# EAGLE design main (EAGLE 7.5.0)
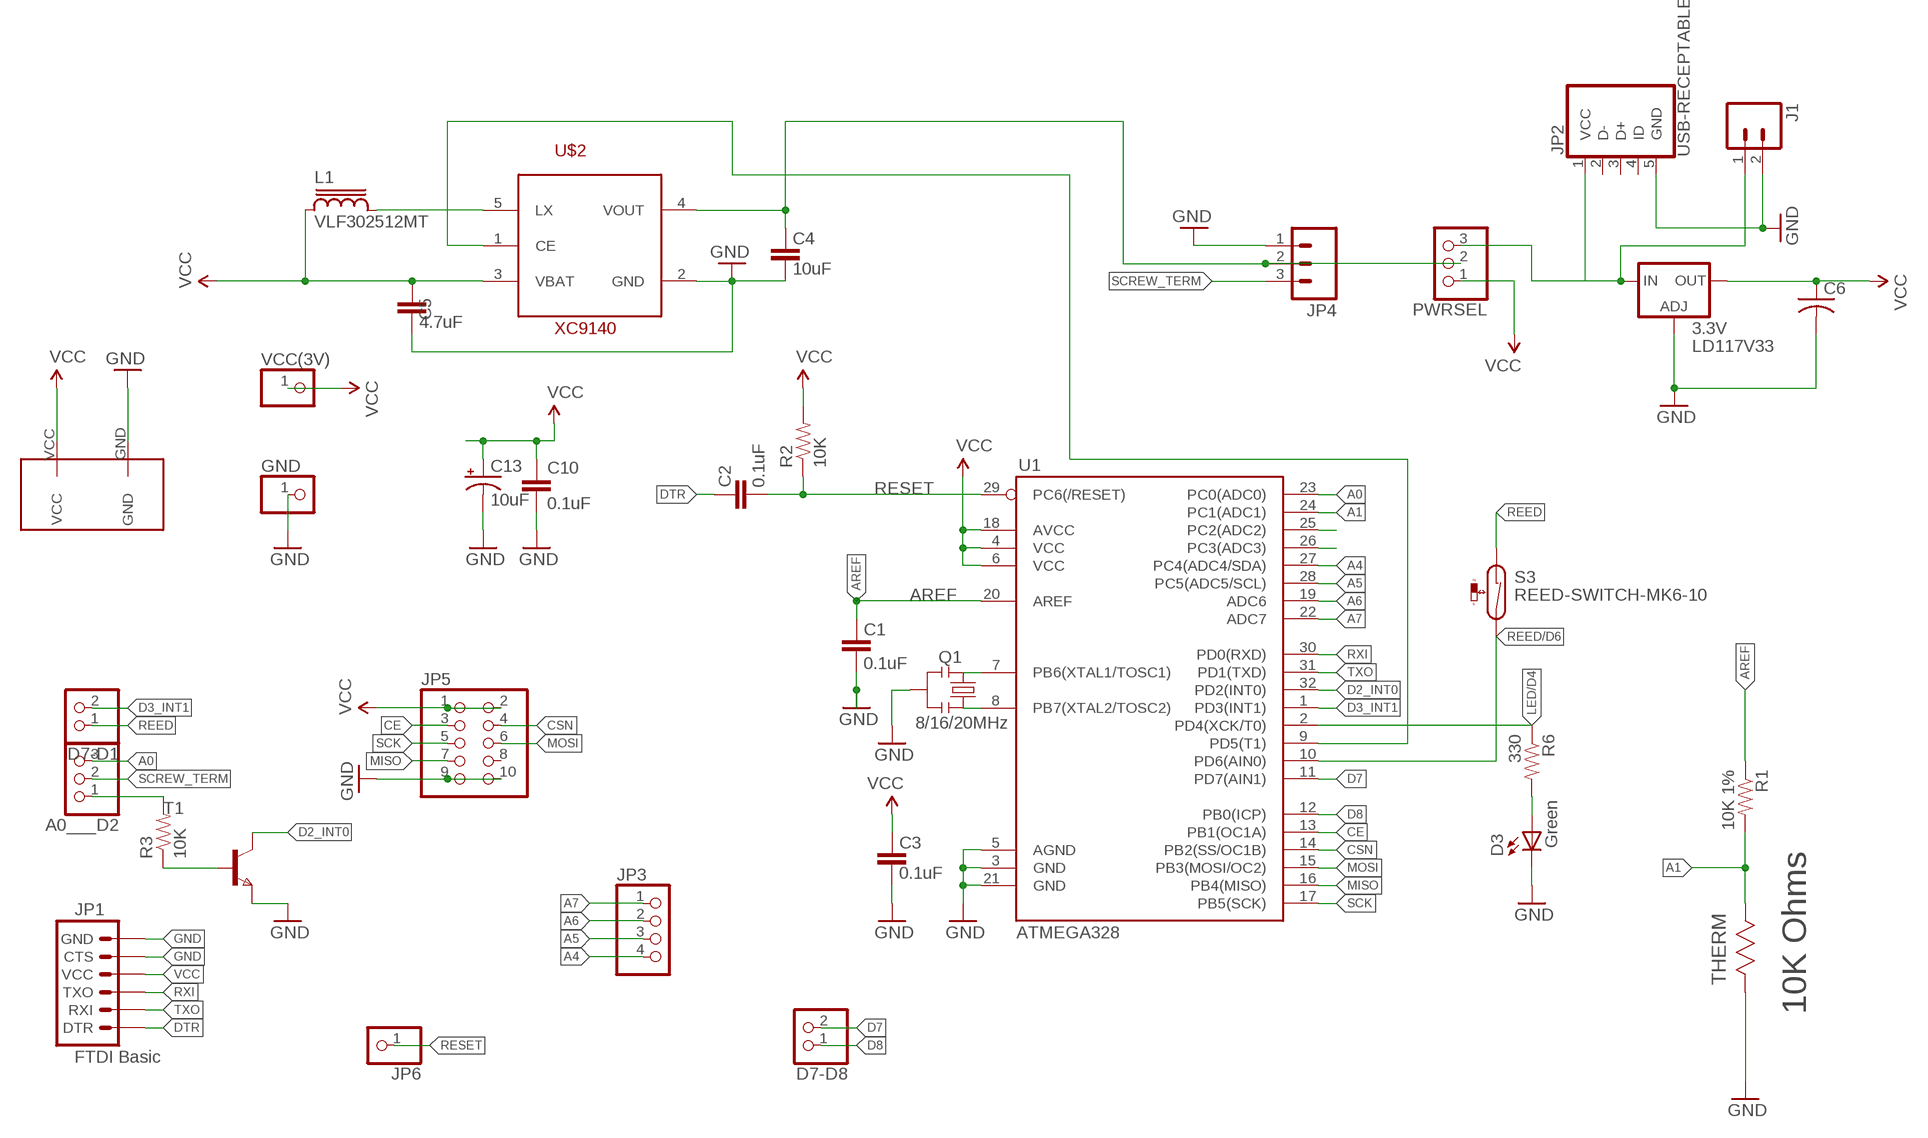
[diagram p0: schematic, sheet 1]

## Parts
3.3V  LD117V33  LD117AV  [TO220L1]
A0___D2  PINHD-1X3  [1X03]
C1  0.1uF  CAP0603-CAP  [0603-CAP]
C2  0.1uF  CAP0603-CAP  [0603-CAP]
C3  0.1uF  CAP0603-CAP  [0603-CAP]
C4  10uF  CAP0603-CAP  [0603-CAP]
C5  4.7uF  CAP0603-CAP  [0603-CAP]
C6  C-US050-075X075  [C050-075X075]
C10  0.1uF  CAP0603-CAP  [0603-CAP]
C13  10uF  CAP_POL1206  [EIA3216]
D3  Green  LED  [0603-LED-ALT1]
D7-D1  PINHD-1X2  [1X02]
D7-D8  PINHD-1X2  [1X02]
GND  PINHD-1X1  [1X01]
J1  M023.5MM  [SCREWTERMINAL-3.5MM-2]
JP1  FTDI Basic  ARDUINO_SERIAL_PROGRAMPTH  [1X06]
JP2  USB-RECEPTABLE  [FCI-10103594-0001LF]
JP3  PINHD-1X4  [1X04]
JP4  M03SCREW  [SCREWTERMINAL-3.5MM-3]
JP5  PINHD-2X5  [2X05]
JP6  PINHD-1X1  [1X01]
L1  VLF302512MT  [VLF302512MT]
PWRSEL  PINHD-1X3  [1X03]
Q1  8/16/20MHz  RESONATOR1:1  [RESONATOR-SMD-1:1]
R1  10K 1%  RESISTOR0603-RES  [0603-RES]
R2  10K  RESISTOR0603-RES  [0603-RES]
R3  10K  RESISTOR0603-RES  [0603-RES]
R6  330  RESISTOR0603-RES  [0603-RES]
S3  REED-SWITCH-MK6-10  [MK6-10]
T1  NPNSOT323  [SOT323]
THERM  10K Ohms  NTCS0603E3103HMT  [RESC1608X95N]
U1  ATMEGA328  ATMEGA168  [TQFP32-08]
U$1  BAT  [AAABATTERY]
U$2  XC9140  [SOT23-5]
VCC(3V)  PINHD-1X1  [1X01]

## Nets
3.3V [vcc]: PWRSEL.1 ; supply symbol labelled VCC
A0: A0___D2.3 U1.23(PC0(ADC0))
A1: R1.2 THERM.1 U1.24(PC1(ADC1))
A2: U1.25(PC2(ADC2))
A3: U1.26(PC3(ADC3))
A4: JP3.4 U1.27(PC4(ADC4/SDA))
A5: JP3.3 U1.28(PC5(ADC5/SCL))
A6: JP3.2 U1.19(ADC6)
A7: JP3.1 U1.22(ADC7)
AREF: C1.2 R1.1 U1.20(AREF)
CE: JP5.3 U1.13(PB1(OC1A))
CSN: JP5.4 U1.14(PB2(SS/OC1B))
D2_INT0: T1.1(C) U1.32(PD2(INT0))
D2_VIA_FET: A0___D2.1 R3.2
D3_INT1: D7-D1.2 U1.1(PD3(INT1))
D5: U1.9(PD5(T1)) U$2.1(CE)
D7: D7-D8.2 U1.11(PD7(AIN1))
D8: D7-D8.1 U1.12(PB0(ICP))
DTR: C2.2 JP1.1(DTR)
GND [vcc]: 3.3V.1(ADJ) C1.1 C3.1 C4.1 C5.1 C6.2 C10.2 C13.C(-) D3.C GND.1 J1.2 JP1.5(CTS) JP1.6(GND) JP2.5(GND) JP4.1 JP5.9 JP5.10 Q1.2 T1.3(E) THERM.2 U1.3(GND) U1.5(AGND) U1.21(GND) U$1.GND U$2.2(GND)
LED/D4: R6.1 U1.2(PD4(XCK/T0))
MISO: JP5.7 U1.16(PB4(MISO))
MOSI: JP5.6 U1.15(PB3(MOSI/OC2))
N$1: Q1.3 U1.8(PB7(XTAL2/TOSC2))
N$2: Q1.1 U1.7(PB6(XTAL1/TOSC1))
N$6: R3.1 T1.2(B)
N$7: D3.A R6.2
N$8: L1.2 U$2.5(LX)
RAW_PWR [vcc]: 3.3V.3(IN) J1.1 JP2.1(VCC) PWRSEL.3
REED: D7-D1.1 S3.1
REED/D6: S3.2 U1.10(PD6(AIN0))
REG_3.3V [vcc]: C4.2 JP4.2 PWRSEL.2 U$2.4(VOUT)
RESET: C2.1 JP6.1 R2.1 U1.29(PC6(/RESET))
RXI: JP1.3(TXO) U1.30(PD0(RXD))
SCK: JP5.5 U1.17(PB5(SCK))
SCREW_TERM: A0___D2.2 JP4.3
TXO: JP1.2(RXI) U1.31(PD1(TXD))
VCC [vcc]: 3.3V.2(OUT) C3.2 C5.2 C6.1 C10.1 C13.A(+) JP1.4(VCC) JP5.1 JP5.2 L1.1 R2.2 U1.4(VCC) U1.6(VCC) U1.18(AVCC) U$1.VCC U$2.3(VBAT) VCC(3V).1
Unconnected: JP2.2(D-) JP2.3(D+) JP2.4(ID) JP5.8

## Library data of the parts
3.3V = v-reg:LD117A?*: Low drop fixed and adjustable positive voltage regulators 1 A Source: http://www.st.com/stonline/products/literature/ds/7194/ld1117axx.pdf
A0___D2 PWRSEL = pinhead:PINHD-1X3: PIN HEADER
C1-C5 C10 = SparkFun:CAP: Capacitor Standard 0603 ceramic capacitor, and 0.1" leaded capacitor.
C6 = rcl:C-US: CAPACITOR, American symbol
C13 = SparkFun:CAP_POL: Capacitor Polarized These are standard SMD and PTH capacitors. Normally 10uF, 47uF, and 100uF in electrolytic and tantalum varieties. Always verify the external diameter of the through hole cap, it varies with capacity, voltage, and manufacturer. The EIA devices should be standard.
D3 = Testing:LED: LEDs Standard schematic elements and footprints for 5mm, 3mm, 1206, and 0603 sized LEDs. 5mm - Spark Fun Electronics SKU : COM-00529 (and others)
D7-D1 D7-D8 = pinhead:PINHD-1X2: PIN HEADER
GND JP6 VCC(3V) = pinhead:PINHD-1X1: PIN HEADER
J1 = SparkFun-Connectors:M02: Standard 2-pin 0.1" header. Use with - straight break away headers ( PRT-00116) - right angle break away headers (PRT-00553) - swiss pins (PRT-00743) - machine pins (PRT-00117) - female headers (PRT-00115) Molex polarized connector foot print use with: PRT-08233 with associated crimp pins and housings. 2.54_SCREWTERM for use with PRT-10571. 3.5mm Screw Terminal footprints for PRT-08084 5mm Screw Terminal footprints for use with PRT-08432; PROD_ID: CONN-08399
JP1 = SparkFun:ARDUINO_SERIAL_PROGRAM
JP2 = daspilker:USB-RECEPTABLE: USB Receptable
JP3 = pinhead:PINHD-1X4: PIN HEADER
JP4 = SparkFun-Connectors:M03: Header 3 Standard 3-pin 0.1" header. Use with straight break away headers (SKU : PRT-00116), right angle break away headers (PRT-00553), swiss pins (PRT-00743), machine pins (PRT-00117), and female headers (PRT-00115). Molex polarized connector foot print use with SKU : PRT-08232 with associated crimp pins and housings.
JP5 = pinhead:PINHD-2X5: PIN HEADER
L1 = inductor-tdk:VLF302512MT
Q1 = Testing:RESONATOR: Resonator Small SMD resonator. This is the itty bitty 10/20MHz resonators with built in caps. CSTCE10M0G55 and CSTCE20M0V53. Footprint for SMD has been used in SFE production for years, and does work okay. 1:1 is an attempt to get larger fillets on the sides so it will be easier to inspect these solders in our AOI machine. The pads have been minimized to match the actual metal under the resonator. To see this relation, it includes an image import of the bottom side of the component. Imported to scale on layer 200.
R1-R3 R6 = SparkFun:RESISTOR: Resistor Basic schematic elements and footprints for 0603, 1206, and PTH resistors.
S3 = switch-reed:REED-SWITCH-: Reed Sensor; OC_FARNELL: unknown
T1 = zetex:NPNSOT323: NPN TRANSISTOR; MPN: DSS4160U-7; OC_FARNELL: 1710696; OC_NEWARK: 25R4558
THERM = Vishay_By_element14_Batch_1:NTCS0603E3103HMT: RESISTOR, 0603; MPN: NTCS0603E3103HMT; OC_FARNELL: 1874161; OC_NEWARK: 63H2050; SUPPLIER: Vishay; TOLERANCE: ± 3%; WATTAGE: 125 mW
U1 = SparkFun:ATMEGA168
U$1 = battery_wilkie:BAT
U$2 = boost:XC9140

## Net classes
0 default: width 0.152 mm
1 vcc: width 0.406 mm
2 GND: width 0.406 mm

## Board
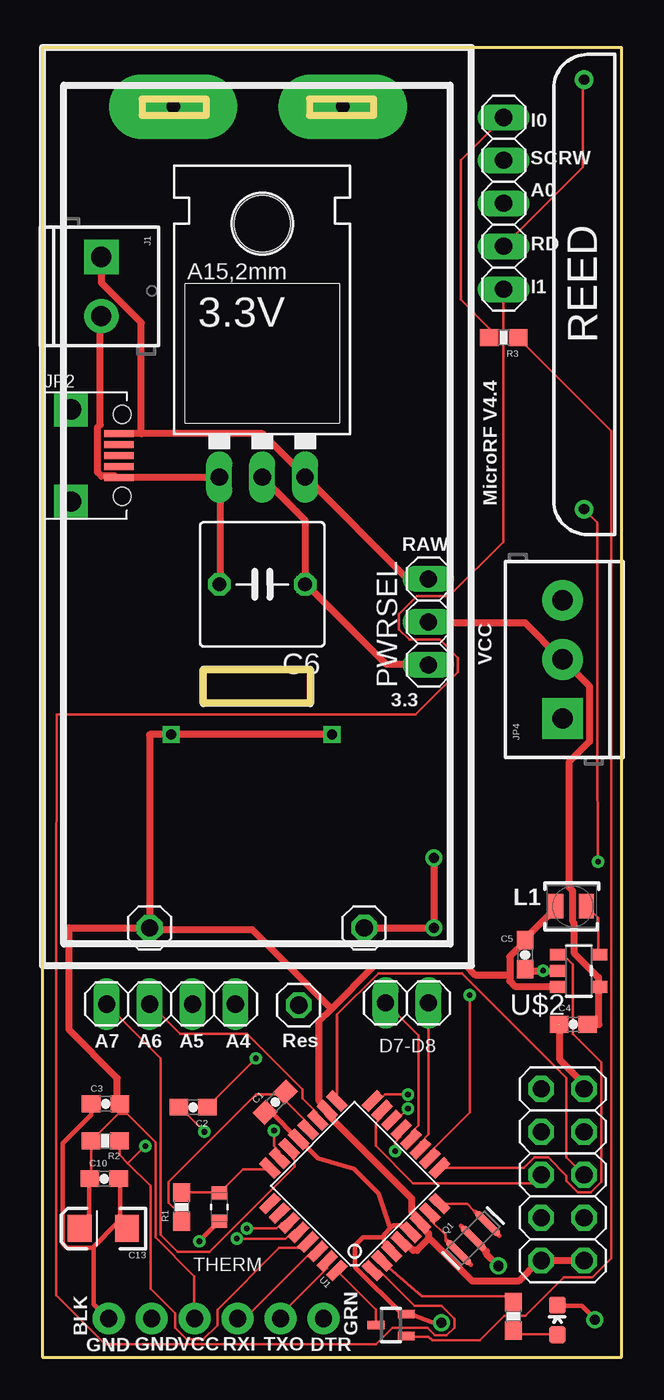
[diagram p1: board, top side]
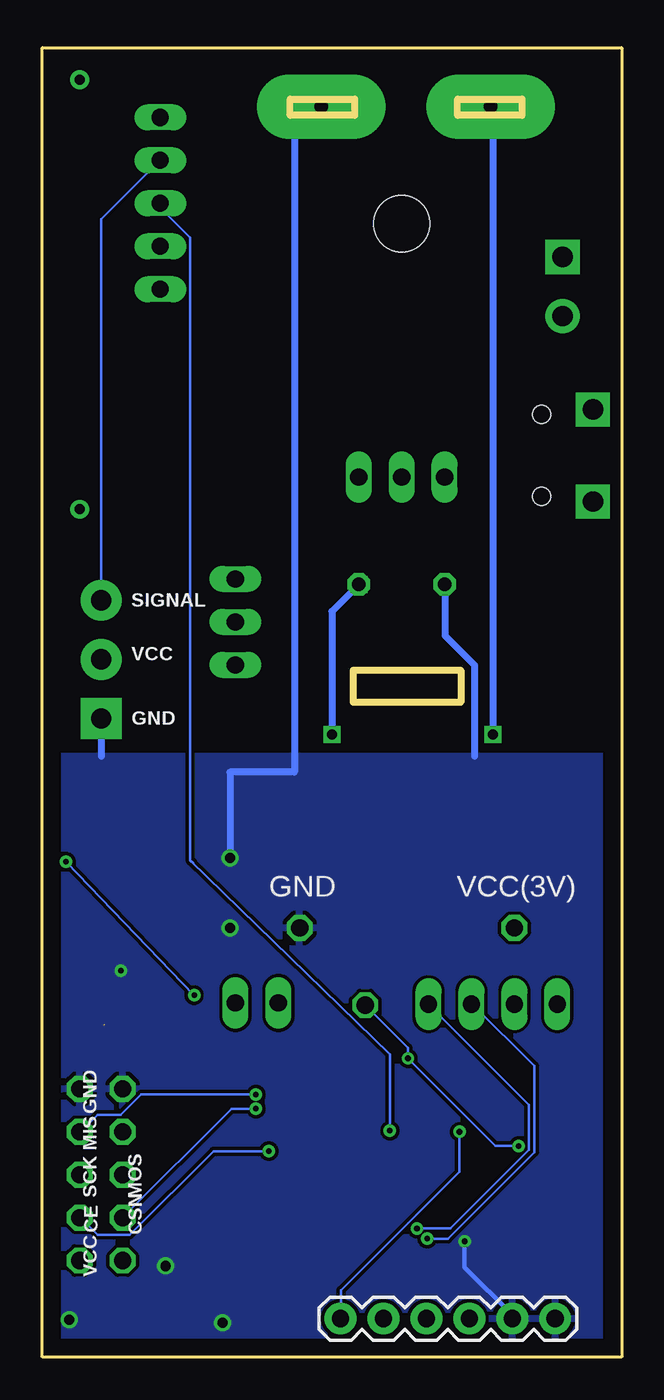
[diagram p2: board, bottom side, seen from below]

Size 34.29 x 77.47 mm. Coordinates in mm from the lower left corner, seen from the top.
Outline: 0,77.47 0,0 34.29,0 34.29,77.47 0,77.47
Outline: 9.53,40.64 9.53,38.73 15.88,38.73 15.88,40.64 9.53,40.64
Outline: 5.91,74.42 5.91,73.47 9.72,73.47 9.72,74.42 5.91,74.42
Outline: 15.81,74.42 15.81,73.47 19.62,73.47 19.62,74.42 15.81,74.42
Copper layers (1*16): Top 0.035mm / dielectric 1.5mm / Bottom 0.035mm
Design rules "default": minimum track width 10mil, minimum drill 24mil, track to track 8mil, track to pad 8mil, pad to pad 8mil, via to via 8mil, smd to smd 8mil, copper to edge 40mil, drill to drill 8mil, minimum pad ring 10mil, minimum via ring 8mil, stop-mask expansion 4mil, vias tented up to drill 0mil, thermal gap 10mil

### Footprints (pad centres in the part's own frame; a part is rotated, then mirrored left to right if it is on the bottom)
TO220L1 = drill 1.016 long: 1 -2.54,-3.81; 2 0,-3.81; 3 2.54,-3.81 | hole 3.302: 0,11.176
1X03 = drill 1.016 long: 1 -2.54,0; 2 0,0; 3 2.54,0
0603-CAP = smd 1.1 x 1: 1 -0.85,0; 2 0.85,0
C050-075X075 = drill 0.813 octagon: 1 -2.54,0; 2 2.54,0
EIA3216 = smd 1.4 x 1.6: A 1.4,0; C -1.4,0
0603-LED-ALT1 = smd 1 x 1: A 0,-0.877; C 0,0.877
1X02 = drill 1.016 long: 1 -1.27,0; 2 1.27,0
1X01 = drill 1.016 octagon: 1 0,0
SCREWTERMINAL-3.5MM-2 = drill 1.2 pad 2.032 square: 1 0,0 | drill 1.2 pad 2.032: 2 3.5,0
1X06 = drill 1.016 pad 1.88: 1 0,0; 2 2.54,0; 3 5.08,0; 4 7.62,0; 5 10.16,0; 6 12.7,0
FCI-10103594-0001LF = smd 0.4 x 1.75: 1 -1.3,4.525; 2 -0.65,4.525; 3 0,4.525; 4 0.65,4.525; 5 1.3,4.525 | drill 1.2 pad 2 square: P$3 -2.725,1.7; P$4 2.725,1.7 | hole 1.05: -2.425,4.73; 2.425,4.73
1X04 = drill 1.016 long: 1 -3.81,0; 2 -1.27,0; 3 1.27,0; 4 3.81,0
SCREWTERMINAL-3.5MM-3 = drill 1.2 pad 2.413 square: 1 0,0 | drill 1.2 pad 2.413: 2 3.5,0; 3 7,0
2X05 = drill 1.016 octagon: 1 -5.08,-1.27; 2 -5.08,1.27; 3 -2.54,-1.27; 4 -2.54,1.27; 5 0,-1.27; 6 0,1.27; 7 2.54,-1.27; 8 2.54,1.27; 9 5.08,-1.27; 10 5.08,1.27
VLF302512MT = smd 0.9 x 1.45: 1 -0.4,0; 2 1.4,0
RESONATOR-SMD-1:1 = smd 0.45 x 1.905: 1 -1.2,0; 2 0,0; 3 1.2,0
0603-RES = smd 1.1 x 1: 1 -0.85,0; 2 0.85,0
MK6-10 = drill 0.6 pad 1.016: 1 -12.7,0; 2 12.7,0
SOT323 = smd 0.5 x 1: 1 0,0.9; 2 -0.65,-0.9; 3 0.65,-0.9
RESC1608X95N = smd 0.762 x 0.94: 1 -0.838,0; 2 0.838,0
TQFP32-08 = smd 1.27 x 0.559: 1 -4.293,2.8; 2 -4.293,2; 3 -4.293,1.2; 4 -4.293,0.4; 5 -4.293,-0.4; 6 -4.293,-1.2; 7 -4.293,-2; 8 -4.293,-2.8; 17 4.293,-2.8; 18 4.293,-2; 19 4.293,-1.2; 20 4.293,-0.4; 21 4.293,0.4; 22 4.293,1.2; 23 4.293,2; 24 4.293,2.8 | smd 0.559 x 1.27: 9 -2.8,-4.293; 10 -2,-4.293; 11 -1.2,-4.293; 12 -0.4,-4.293; 13 0.4,-4.293; 14 1.2,-4.293; 15 2,-4.293; 16 2.8,-4.293; 25 2.8,4.293; 26 2,4.293; 27 1.2,4.293; 28 0.4,4.293; 29 -0.4,4.293; 30 -1.2,4.293; 31 -2,4.293; 32 -2.8,4.293
AAABATTERY = drill 0.8 pad 3.81 long: GND 16.51,-1.27; VCC 6.477,-1.27
SOT23-5 = smd 0.7 x 1: 1 0.95,1.2; 2 0,1.2; 3 -0.95,1.2; 4 -0.95,-1.2; 5 0.95,-1.2

### Placement (x,y rotation side)
3.3V  13.02,55.88 0 top
A0___D2  27.3,70.8 270 top
C1  13.79,15.09 45 top
C2  8.93,14.8 180 top
C3  3.75,14.99 0 top
C4  31.43,19.68 0 top
C5  28.57,23.81 90 top
C6  13.02,45.72 180 top
C10  3.67,10.57 0 top
C13  3.62,7.62 180 top
D3  30.48,2.21 0 top
D7-D1  27.3,64.45 270 top
D7-D8  21.59,20.95 0 top
GND  19.05,25.4 0 top
J1  3.49,65.09 270 top
JP1  16.64,2.29 0 bottom
JP2  0,53.34 270 top
JP3  7.62,20.89 0 top
JP4  30.8,37.78 90 top
JP5  30.8,10.79 90 top
JP6  15.18,20.83 0 top
L1  30.8,26.67 0 top
PWRSEL  22.86,43.5 90 top
Q1  25.5,7.05 45 top
R1  8.26,8.89 90 top
R2  3.72,12.8 180 top
R3  27.3,60.33 180 top
R6  27.88,2.43 270 top
S3  32.07,62.87 270 top
T1  20.64,1.91 90 top
THERM  10.48,8.89 270 top
U1  18.49,10.15 135 top
U$1  1.27,75.25 0 top
U$2  31.75,22.86 90 top
VCC(3V)  6.35,25.4 0 top

### Tracks (layer width: path | path; a pad name or v marks a point on that pad's centre or on a via)
3.3V
  Top 0.406: 15.7,45.64 20.34,41 22.86,41 PWRSEL.1
A0  (via drill 0.33)
  Top 0.152: v13.72,13.41 13.72,12.5 14.02,12.19 14.02,11.81 U1.23
  Bottom 0.152: 27.28,68.2 A0___D2.3 | v13.72,13.41 13.72,17.91 25.53,29.4 | 25.38,29.25 25.53,29.4 | 27.28,68.12 A0___D2.3 | 27.28,68.05 A0___D2.3 | 25.53,29.4 25.53,66.22 27.28,67.97 A0___D2.3
A1
  Top 0.152: R1.2 8.31,9.75 10.44,9.75 THERM.1 10.52,9.75 11.89,11.12 13.41,11.12 U1.24
A4  (via drill 0.33)
  Top 0.152: v12.12,7.62 13.87,7.62 14.17,7.92 14.55,7.92 U1.27
  Bottom 0.152: v12.12,7.62 10.13,7.62 5.49,12.27 5.49,14.94 JP3.4
A5  (via drill 0.33)
  Top 0.152: v11.51,7.01 14.4,7.01 14.78,7.39 U1.28
  Bottom 0.152: v11.51,7.01 10.29,7.01 5.18,12.12 5.18,17.22 8.84,20.88 JP3.3
A6
  Top 0.152: U1.19 16.23,14.1 16.23,14.48 15.39,15.32 15.39,15.85 12.12,19.13 8.15,19.13 6.4,20.88 JP3.2
A7
  Top 0.152: U1.22 14.63,12.27 14.63,11.96 14.94,11.66 14.94,11.28 9.91,6.25 8,6.25 7.01,7.24 7.01,17.68 JP3.1
AREF
  Top 0.152: U1.20 15.7,13.49 15.7,13.87 14.33,15.24 14.33,15.54 C1.2 14.25,15.54 12.65,15.54 7.47,10.36 7.47,9.14 8.23,8.38 8.23,8.08 R1.1
CE  (via drill 0.33)
  Top 0.152: v20.88,12.19 20.88,12.72 21.18,13.03 21.18,13.41 U1.13
  Bottom 0.152: v20.88,12.19 24.16,12.19 29.11,7.24 31.01,7.24 32,8.23 JP5.3
CSN  (via drill 0.33)
  Top 0.152: v21.64,14.71 21.03,14.1 20.73,14.1 U1.14
  Bottom 0.152: v21.64,14.71 23.09,14.71 29.49,8.31 JP5.4
D2_INT0
  Top 0.152: T1.1 19.74,2.82 17.45,5.11 U1.32
D2_VIA_FET
  Top 0.152: R3.2 26.45,60.86 24.77,62.55 24.77,70.8 A0___D2.1
D3_INT1
  Top 0.152: U1.1 19.58,5.11 19.96,5.11 22.02,3.05 23.62,3.05 24.38,2.29 24.38,1.75 23.93,1.29 23.24,1.29 22.78,1.75 20.73,1.75 19.74,0.76 3.73,0.76 0.84,3.66 0.84,25.3 0.86,38.02 22.1,38.02 24.61,40.54 24.61,41.38 23.55,42.44 21.72,42.44 21.11,43.05 21.11,43.97 22.17,45.03 24.08,45.03 27.28,48.23 27.28,63.17 D7-D1.2
D5
  Top 0.152: U1.9 23.55,11.2 28.5,11.2 29.11,11.81 29.95,11.81 31.01,10.74 31.01,10.44 31.7,9.75 32.46,9.75 33.07,10.36 33.07,17.45 31.39,19.13 31.39,23.24 30.63,24 U$2.1
D7
  Top 0.152: D7-D8.2 22.86,13.18 22.4,12.72 22.4,12.34 U1.11
D8
  Top 0.152: U1.12 21.87,12.95 21.87,13.34 22.25,13.72 22.25,19.05 20.34,20.95 D7-D8.1
DTR  (via drill 0.33)
  Top 0.152: v9.6,13.34 8.15,14.78 C2.2
  Bottom 0.152: v9.6,13.34 9.6,10.97 16.61,3.96 16.61,2.29 JP1.1
GND  (via drill 0.33, 0.6)  (1 unrouted)
  Top 0.152: 23.46,1.92 23.47,1.91 v23.62,2.03
  Top 0.254: C10.2 4.6,10.55 4.6,8.04 4.94,7.7 C13.C 4.5,8 2.97,6.48 | 20.21,7.09 20.21,7.25 20.61,7.66 | 20.21,7.09 20.21,6.76 20.7,6.28 U1.3 | 20.61,7.66 20.78,7.82 21.26,7.82 21.75,7.33 U1.5 | 20.61,7.66 20.53,7.74 19.9,9.69 18.45,11.14 16.33,11.78 15.2,12.91 U1.21 15.09,12.95 13.56,14.48 13.26,14.48 C1.1 | 2.97,6.48 1.45,6.48 1.22,6.71 1.22,12.65 2.9,14.33 2.9,14.94 C3.1 | D3.C 30.48,3.05 31.93,3.05 32.69,2.29 v32.7,2.22 | 2.97,6.48 3.05,6.4 3.05,3.12 3.89,2.29 JP1.6 | 23.46,1.92 21.91,2.52 21.57,2.52 T1.3 21.41,2.52 21.34,2.52 18.52,5.33 18.52,6.63 18.97,7.09 20.21,7.09 | v9.3,6.86 10.44,8 THERM.2
  Top 0.406: v26.99,5.4 26.29,6.1 26.29,6.25 Q1.2 | 30.63,19.66 30.63,17.6 32,16.23 32,15.93 JP5.9 | GND.1 v23.18,25.4 v23.18,29.53 | v29.64,22.86 28.65,22.86 28.57,22.94 C5.1 | v29.64,22.86 U$2.2 | v29.64,22.87 v29.64,22.86 | C6.2 10.52,45.72 10.52,51.89 3.3V.1 10.44,52.05 4.57,52.05 JP2.5 4.34,52.12 3.5,52.12 3.28,52.35 3.28,55.02 3.43,55.17 3.43,61.57 J1.2
  Bottom 0.254: 4.04,2.29 JP1.6 | v9.3,6.86 9.3,5.33 6.48,2.52 JP1.5
  Bottom 0.406: JP1.5 6.43,2.34 | 30.79,35.56 30.79,37.72 JP4.1 | 8.69,35.56 8.69,40.92 10.44,42.67 10.44,45.72 C6.2 | U$1.GND 19.37,73.98 19.37,34.61 23.18,34.61 v23.18,29.53
  pour Bottom: 0,35.56 0,0 34.29,0 34.29,35.56
LED/D4
  Top 0.152: R6.1 27.81,3.59 22.48,3.59 20.12,5.64 U1.2
MISO  (via drill 0.33)
  Top 0.152: v21.64,15.54 20.27,15.54 19.89,15.16 19.58,15.16 U1.16
  Bottom 0.152: v21.64,15.54 28.42,15.54 29.64,14.33 31.01,14.33 32,13.34 JP5.7
MOSI
  Top 0.152: U1.15 20.04,14.55 20.04,14.17 19.74,13.87 19.74,12.5 21.95,10.29 29.03,10.29 29.49,10.74 JP5.6
N$1
  Top 0.152: U1.8 23.55,9.07 25.15,9.07 25.53,8.69 25.63,8.62
N$2
  Top 0.152: U1.7 23.01,8.46 23.01,8.08 23.85,7.24 23.85,7.01 23.93,6.92
N$6
  Top 0.152: T1.2 21.57,1.22 22.86,1.22 23.09,0.99 25.91,0.99 27.36,2.44 28.57,2.44 30.86,4.72 32.54,4.72 33.68,5.87 33.68,54.8 R3.1
N$7
  Top 0.152: D3.A 30.48,1.37 28.04,1.37 27.89,1.52 R6.2
N$8
  Top 0.152: U$2.5 32.92,23.85 32.92,25.98 32.23,26.67 L1.2
RAW_PWR
  Top 0.406: 5.87,54.63 13.03,54.63 15.54,52.12 3.3V.3 15.7,51.97 21.57,46.1 22.86,46.1 PWRSEL.3 | 5.87,54.63 4.57,54.63 JP2.1 | 5.87,54.63 5.87,61.19 3.5,63.55 3.5,65.08 J1.1
REED
  Top 0.152: S3.1 32,75.51 32,70.41 27.36,65.76 D7-D1.1
REED/D6  (via drill 0.33)
  Top 0.152: v25.3,21.41 25.3,14.48 23.01,12.19 23.01,11.81 U1.10 | v32.88,29.31 32.88,29.57 32.84,36.2 32.84,49.38 32.08,50.14 S3.2
  Bottom 0.152: v32.88,29.31 v25.3,21.41
REG_3.3V
  Top 0.406: PWRSEL.2 22.86,43.43 28.57,43.43 30.63,41.38 JP4.2 30.86,41.22 32.38,39.7 32.38,36.42 31.17,35.2 31.17,27.81 31.37,27.61 31.37,25.78 31.47,25.68 31.47,23.93 32.92,22.48 32.92,21.95 U$2.4 32.95,19.68 C4.2
RESET  (via drill 0.33)
  Top 0.152: 5.07,11.47 6.4,10.13 6.4,4.04 7.85,2.59 7.85,1.75 8.53,1.07 9.53,1.07 10.36,1.91 10.36,2.82 14.02,6.48 15.39,6.48 15.7,6.78 U1.29 | 5.07,11.47 4.57,11.96 R2.1 | v12.65,17.68 9.83,14.86 C2.1 | v6.1,12.5 5.07,11.47
  Bottom 0.152: JP6.1 15.16,20.8 12.65,18.29 v12.65,17.68 7.47,12.5 v6.1,12.5
RXI
  Top 0.152: JP1.3 11.96,2.29 15.93,6.25 16.23,6.25 U1.30
SCK
  Top 0.152: U1.17 17.45,20.27 19.89,22.71 24.84,22.71 31.01,16.54 31.01,11.81 32,10.82 JP5.5
SCREW_TERM
  Bottom 0.152: JP4.3 30.8,67.31 A0___D2.2
TXO
  Top 0.152: JP1.2 14.1,2.52 16.84,5.26 16.84,5.64 U1.31
VCC  (via drill 0.6)
  Top 0.152: 2.9,12.8 2.9,10.67 C10.1 | 2.9,12.8 4.53,14.44 | 4.53,14.44 4.57,14.48 4.57,14.94 C3.2 4.57,15.01 | 2.9,12.8 R2.2 | 6.1,25.38 6.33,25.38 VCC(3V).1 6.4,25.38 | JP1.4 8.99,2.29 8.99,4.8 6.71,7.09 6.71,12.72 5.03,14.4 4.57,14.4 4.53,14.44
  Top 0.254: 21.24,6.8 U1.4 | C10.1 2.77,10.55 2.77,8.15 2.31,7.7 C13.A
  Top 0.406: 4.57,15.01 4.45,15.14 4.45,16.51 1.59,19.37 1.59,25.4 VCC(3V).1 | 22.86,7.01 22.17,6.33 21.95,6.33 21.49,6.78 21.34,6.78 U1.4 | 22.86,7.01 22.86,7.32 22.4,7.77 U1.6 22.33,8.15 21.87,8.61 21.87,9.37 16.92,14.33 16.92,14.55 U1.18 16.76,14.78 16.38,15.16 16.38,19.89 17.11,20.61 | JP5.1 JP5.2 29.34,5.64 28.19,4.5 25.45,4.5 23.01,6.93 22.86,7.01 | 27.66,22.63 27.66,23.7 28.57,24.61 C5.2 28.65,24.84 30.33,26.52 30.33,26.67 L1.1 | 27.66,22.63 27.66,22.25 27.96,21.95 30.48,21.95 U$2.3 | 27.66,22.63 25.6,22.63 25.07,23.16 19.66,23.16 17.11,20.61 | 17.11,20.61 12.42,25.3 6.48,25.3 VCC(3V).1 | VCC(3V).1 6.35,36.83 v7.62,36.83 v17.14,36.83 | C6.1 v15.54,45.72 15.54,49.53 13.03,52.05 3.3V.2
  Bottom 0.406: U$1.VCC 7.62,73.98 v7.62,36.83 | v15.54,45.72 17.14,44.12 v17.14,36.83

### Text on the board
tPlace: I0 | SCRW | A0 | RD | I1 | REED | MicroRF V4.4 | RAW | VCC | 3.3 | A7 | A6 | A5 | A4 | Res | BLK | GND | GRN | GND | VCC | RXI | TXO | DTR
bPlace: SIGNAL | VCC | GND | GND | MIS | MOS | SCK | CE | CSN | VCC
tValues: Valid combinations: | 168V / 3.3V Reg / 8MHz | 168 / 5V Reg / 16MHz | 168 / 5V Reg / 20MHz | Mark back accordingly